# EAGLE design HELLO1 (EAGLE 7.5.0)
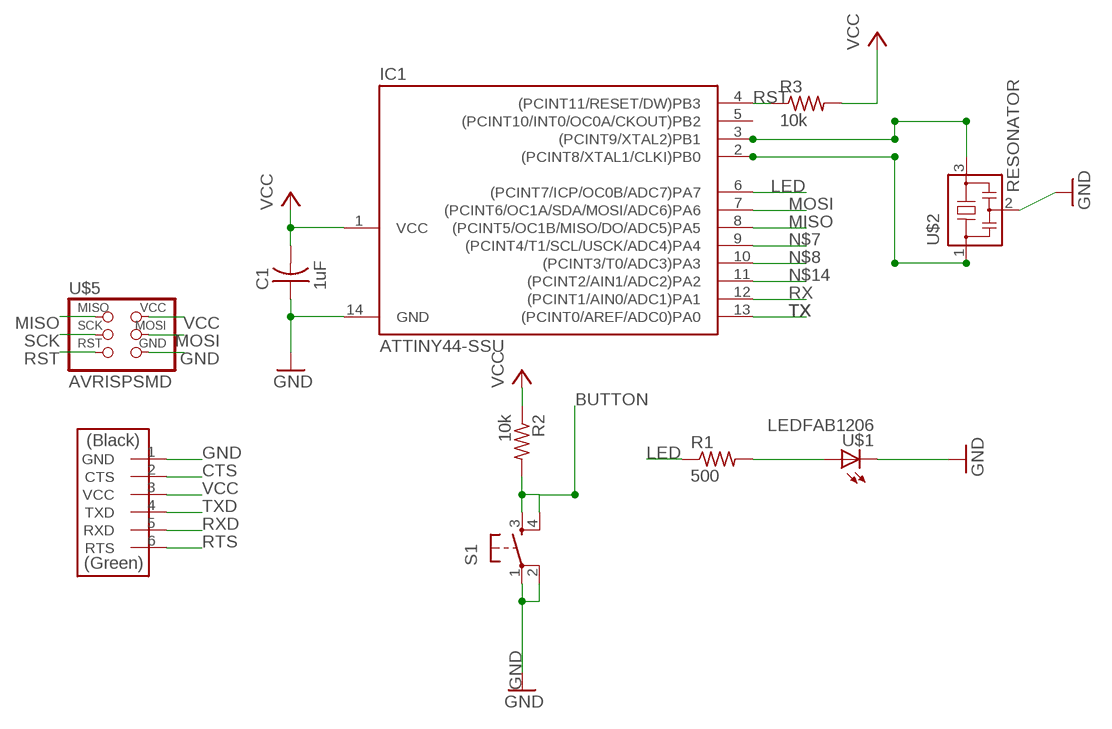
[diagram p0: schematic, sheet 1]

## Parts
C1  1uF  CAP-US1206FAB  [C1206FAB]
IC1  ATTINY44-SSU  [SOIC14]
R1  500  RES-US1206FAB  [R1206FAB]
R2  10k  RES-US1206FAB  [R1206FAB]
R3  10k  RES-US1206FAB  [R1206FAB]
S1  6MM_SWITCH6MM_SWITCH  [6MM_SWITCH]
U$1  LEDFAB1206  [LED1206FAB]
U$2  RESONATOR  [EFOBM]
U$4  FTDI-SMD-HEADER  [1X06SMD]
U$5  AVRISPSMD  [2X03SMD]

## Nets
BUTTON: R2.2 S1.3(S) S1.4(S1)
CTS: U$4.2(CTS)
GND: C1.1 IC1.14(GND) S1.1(P) S1.2(P1) U$1.2(C) U$2.2 U$4.1(GND) U$5.6(GND)
LED: IC1.6((PCINT7/ICP/OC0B/ADC7)PA7) R1.1
MISO: IC1.8((PCINT5/OC1B/MISO/DO/ADC5)PA5) U$5.1(MISO)
MOSI: IC1.7((PCINT6/OC1A/SDA/MOSI/ADC6)PA6) U$5.4(MOSI)
N$1: IC1.2((PCINT8/XTAL1/CLKI)PB0) U$2.1
N$2: IC1.3((PCINT9/XTAL2)PB1) U$2.3
N$3: R1.2 U$1.1(A)
N$7: IC1.9((PCINT4/T1/SCL/USCK/ADC4)PA4)
N$8: IC1.10((PCINT3/T0/ADC3)PA3)
N$14: IC1.11((PCINT2/AIN1/ADC2)PA2)
RST: IC1.4((PCINT11/RESET/DW)PB3) R3.1 U$5.5(RST)
RTS: U$4.6(RTS)
RX: IC1.12((PCINT1/AIN0/ADC1)PA1)
RXD: U$4.5(RXD)
SCK: U$5.3(SCK)
TX: IC1.13((PCINT0/AREF/ADC0)PA0)
TXD: U$4.4(TXD)
VCC: C1.2 IC1.1(VCC) R2.1 R3.2 U$4.3(VCC) U$5.2(VCC)
Unconnected: IC1.5((PCINT10/INT0/OC0A/CKOUT)PB2)

## Library data of the parts
C1 = fab:CAP-US
IC1 = fab:ATTINY44
R1-R3 = fab:RES-US: Resistor (US Symbol) Variants with postfix FAB are widened to allow the routing of internal traces
S1 = fab:6MM_SWITCH: OMRON SWITCH
U$1 = fab:LED: LED
U$2 = fab:RESONATOR
U$4 = fab:FTDI-SMD-HEADER
U$5 = fab:AVRISP

## Board
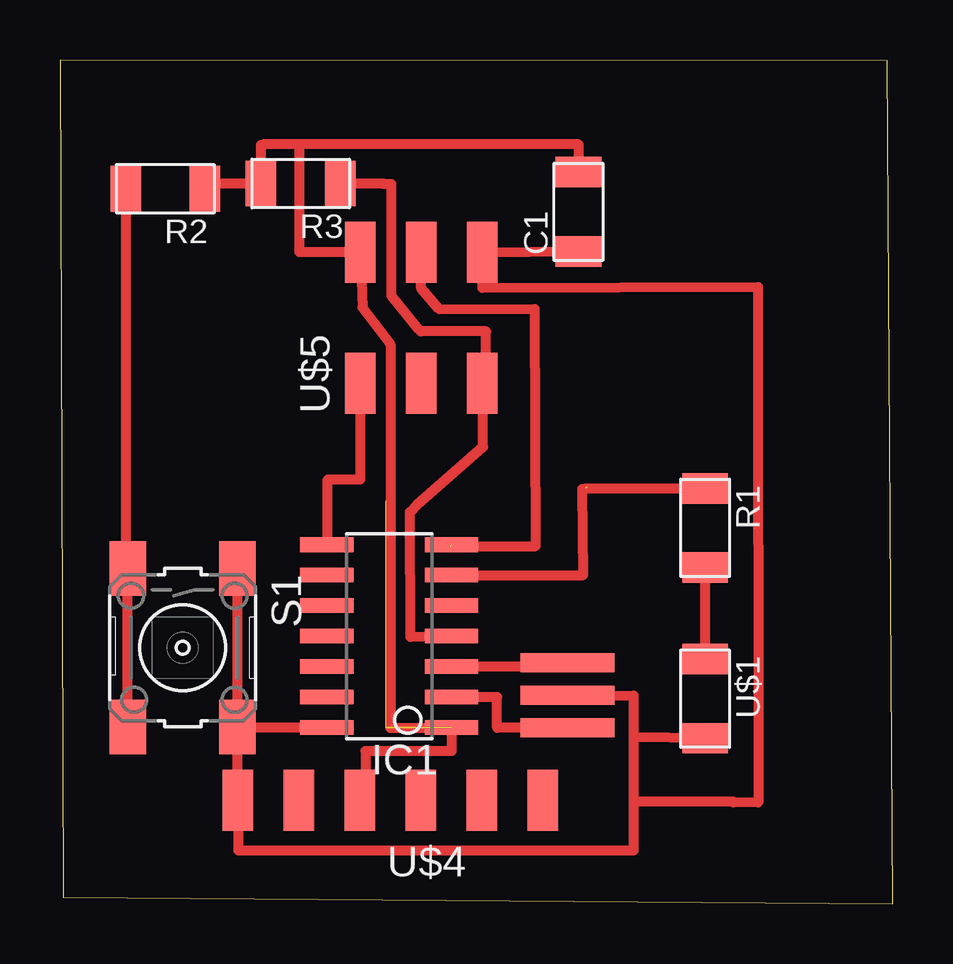
[diagram p1: board, top side]

Size 34.72 x 35.16 mm. Coordinates in mm from the lower left corner, seen from the top.
Outline: 0.14,0.27 34.72,0 34.48,35.12 0,35.16 0.14,0.27
Copper layers (1*16): Top 0.035mm / dielectric 1.5mm / Bottom 0.035mm
Design rules "default *": minimum track width 10mil, minimum drill 24mil, track to track 16mil, track to pad 16mil, pad to pad 16mil, via to via 16mil, smd to smd 16mil, copper to edge 40mil, drill to drill 8mil, minimum pad ring 10mil, minimum via ring 8mil, stop-mask expansion 4mil, vias tented up to drill 0mil, thermal gap 10mil

### Footprints (pad centres in the part's own frame; a part is rotated, then mirrored left to right if it is on the bottom)
C1206FAB = smd 1.27 x 1.905: 1 -1.651,0; 2 1.651,0
SOIC14 = smd 0.61 x 2.21: 1 -3.81,-2.603; 2 -2.54,-2.603; 3 -1.27,-2.603; 4 0,-2.603; 5 1.27,-2.603; 6 2.54,-2.603; 7 3.81,-2.603; 8 3.81,2.603; 9 2.54,2.603; 10 1.27,2.603; 11 0,2.603; 12 -1.27,2.603; 13 -2.54,2.603; 14 -3.81,2.603
R1206FAB = smd 1.27 x 1.905: 1 -1.651,0; 2 1.651,0
6MM_SWITCH = smd 2.286 x 1.524: 1 -3.302,2.286; 2 3.302,2.286; 3 -3.302,-2.286; 4 3.302,-2.286
LED1206FAB = smd 1.27 x 1.905: 1 -1.651,0; 2 1.651,0
EFOBM = smd 0.8 x 3.9: 1 -1.35,0; 2 0,0; 3 1.35,0
1X06SMD = smd 2.54 x 1.27: 1 0,6.35; 2 0,3.81; 3 0,1.27; 4 0,-1.27; 5 0,-3.81; 6 0,-6.35
2X03SMD = smd 2.54 x 1.27: 1 -2.54,2.54; 2 2.92,2.54; 3 -2.54,0; 4 2.92,0; 5 -2.54,-2.54; 6 2.92,-2.54

### Placement (x,y rotation side)
C1  21.62,28.83 90 top
IC1  13.73,11.15 90 top
R1  26.9,15.66 270 top
R2  4.39,29.79 180 top
R3  10.03,30.01 180 top
S1  5.12,10.67 270 top
U$1  26.9,8.55 270 top
U$2  21.16,8.69 90 top
U$4  13.77,4.31 90 top
U$5  15.06,24.23 90 top

### Tracks (layer width: path | path; a pad name or v marks a point on that pad's centre or on a via)
BUTTON
  Top 0.406: R2.2 2.74,13.18 S1.3 S1.4
GND
  Top 0.406: IC1.14 7.4,7.34 S1.2 | S1.2 S1.1 | U$2.2 23.91,8.67 23.91,6.95 | 23.91,6.95 23.91,4.25 | 23.91,4.25 23.91,2.22 7.43,2.22 U$4.1 7.4,4.31 S1.2 | U$1.2 23.91,6.95 | C1.1 U$5.6 17.6,25.67 29.1,25.7 29.11,4.22 28.05,4.23 28.05,4.25 23.91,4.25
LED  (1 unrouted)
  Top 0.406: IC1.6 21.82,13.69 21.78,17.27 21.93,17.31 R1.1
MISO
  Top 0.406: IC1.8 11.16,14.96 11.16,17.68 12.52,17.68 U$5.1
MOSI  (1 unrouted)
  Top 0.406: 16.28,14.9 19.84,14.9 19.8,24.79 15.81,24.78 15.06,25.64 U$5.4 14.87,27.15
N$1
  Top 0.406: U$2.1 20.74,7.33 18.22,7.33 18.22,8.61 IC1.2
N$2
  Top 0.406: U$2.3 21.35,9.88 IC1.3
N$3
  Top 0.406: U$1.1 R1.2
RST
  Top 0.406: 11.68,29.91 R3.1 13.49,30.01 13.49,29.98 13.82,29.98 13.82,25.34 14.97,23.93 15.05,23.85 17.77,23.85 17.75,21.69 U$5.5 17.6,20.88 17.64,20.84 17.64,19.04 14.9,16.65 14.59,16.32 14.6,11.11 16.32,11.16 IC1.4
VCC  (2 unrouted)
  Top 0.406: 12.52,27.09 U$5.2 | R2.1 6.29,30.01 R3.2 8.38,31.62 8.52,31.62 8.52,31.66 9.98,31.66 | U$5.2 9.98,27.15 9.98,31.66 | 9.98,31.66 21.59,31.66 21.62,31.64 C1.2 | U$4.3 12.39,4.31 12.39,5.12 12.74,5.12 12.74,6.36 16.33,6.36 IC1.1 13.78,7.33 13.78,23.3 12.61,24.84 U$5.2